# EAGLE design Omnia_MainBoard (EAGLE 9.7.0)
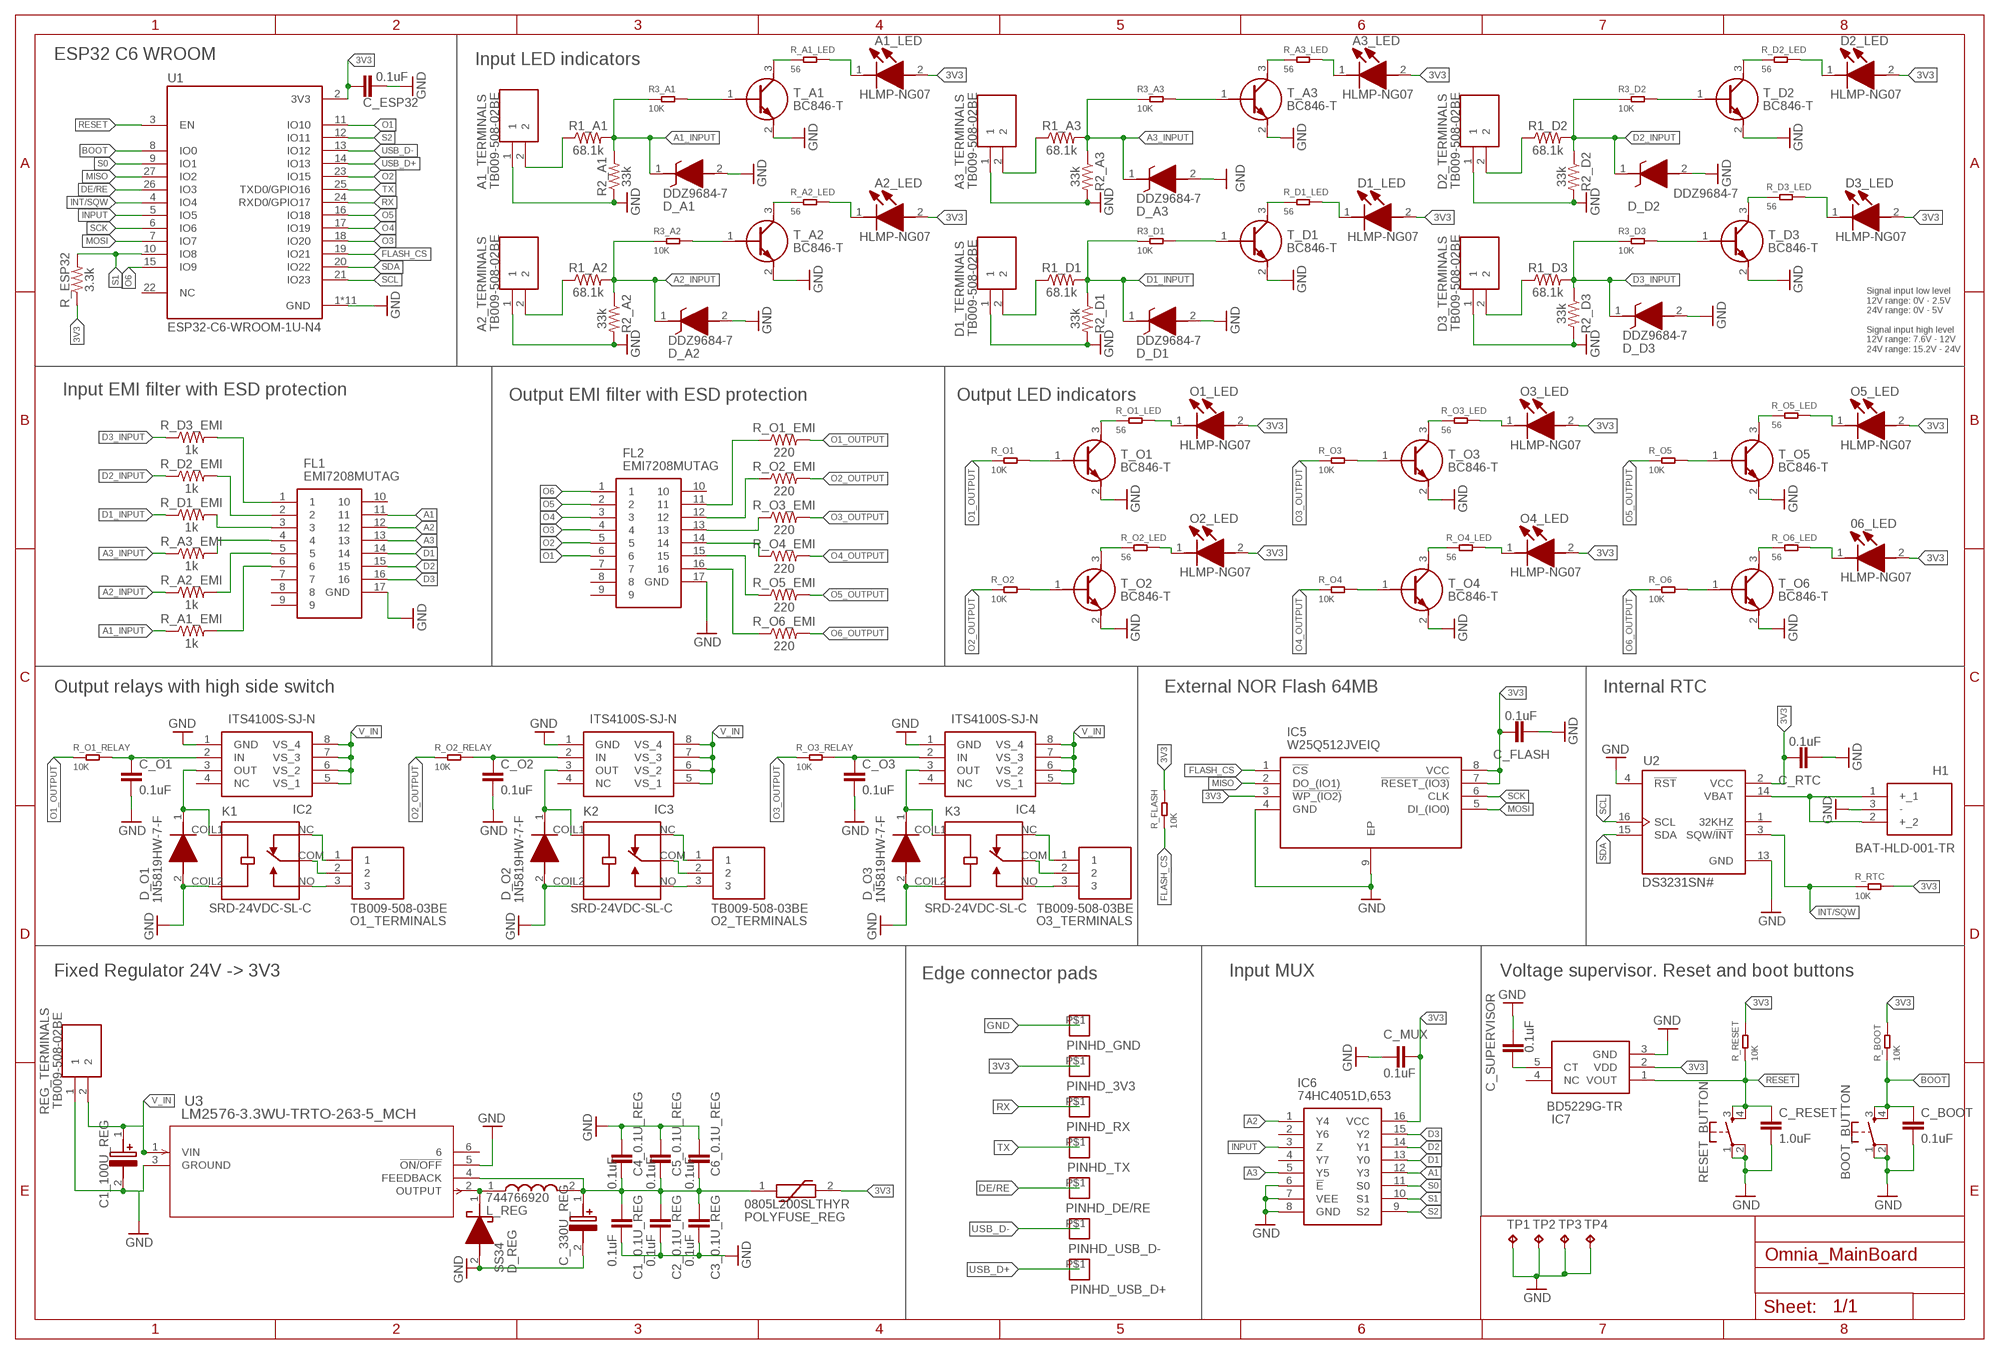
[diagram p0: schematic, sheet 1]

## Parts
06_LED  HLMP-NG07  [HLMPNG07]
A1_LED  HLMP-NG07  [HLMPNG07]
A1_TERMINALS  TB009-508-02BE  [CUI_TB009-508-02BE]
A2_LED  HLMP-NG07  [HLMPNG07]
A2_TERMINALS  TB009-508-02BE  [CUI_TB009-508-02BE]
A3_LED  HLMP-NG07  [HLMPNG07]
A3_TERMINALS  TB009-508-02BE  [CUI_TB009-508-02BE]
BOOT_BUTTON  BUTTON  SPARKFUN-SWITCHES_MOMENTARY-SWITCH-SPST-2-SMD-4.6X2.8MM  [SPARKFUN-SWITCHES_TACTILE_SWITCH_SMD_4.6X2.8MM]
C1_0.1U_REG  0.1uF  0.1UF-0402-16V-10%  [0402]
C1_100U_REG  865060653010  [CAPAE830X1050N]
C2_0.1U_REG  0.1uF  0.1UF-0402-16V-10%  [0402]
C3_0.1U_REG  0.1uF  0.1UF-0402-16V-10%  [0402]
C4_0.1U_REG  0.1uF  0.1UF-0402-16V-10%  [0402]
C5_0.1U_REG  0.1uF  0.1UF-0402-16V-10%  [0402]
C6_0.1U_REG  0.1uF  0.1UF-0402-16V-10%  [0402]
C_330U_REG  865230657014  [CAPAE1030X1080N]
C_BOOT  0.1uF  0.1UF-0402-16V-10%  [0402]
C_ESP32  0.1uF  0.1UF-0402-16V-10%  [0402]
C_FLASH  0.1uF  0.1UF-0402-16V-10%  [0402]
C_MUX  0.1uF  0.1UF-0402-16V-10%  [0402]
C_O1  0.1uF  0.1UF-0402-16V-10%  [0402]
C_O2  0.1uF  0.1UF-0402-16V-10%  [0402]
C_O3  0.1uF  0.1UF-0402-16V-10%  [0402]
C_RESET  1.0uF  1.0UF-0603-16V-10%  [0603]
C_RTC  0.1uF  0.1UF-0402-16V-10%  [0402]
C_SUPERVISOR  0.1uF  0.1UF-0402-16V-10%  [0402]
D1_LED  HLMP-NG07  [HLMPNG07]
D1_TERMINALS  TB009-508-02BE  [CUI_TB009-508-02BE]
D2_LED  HLMP-NG07  [HLMPNG07]
D2_TERMINALS  TB009-508-02BE  [CUI_TB009-508-02BE]
D3_LED  HLMP-NG07  [HLMPNG07]
D3_TERMINALS  TB009-508-02BE  [CUI_TB009-508-02BE]
D_A1  DDZ9684-7  [SOD3716X145N]
D_A2  DDZ9684-7  [SOD3716X145N]
D_A3  DDZ9684-7  [SOD3716X145N]
D_D1  DDZ9684-7  [SOD3716X145N]
D_D2  DDZ9684-7  [SOD3716X145N]
D_D3  DDZ9684-7  [SOD3716X145N]
D_O1  1N5819HW-7-F  [SOD3716X145N]
D_O2  1N5819HW-7-F  [SOD3716X145N]
D_O3  1N5819HW-7-F  [SOD3716X145N]
D_REG  SS34  [DIOM7959X262N]
FL1  EMI7208MUTAG  [EMI7208MUTAG]
FL2  EMI7208MUTAG  [EMI7208MUTAG]
H1  BAT-HLD-001-TR  [BATHLD001TR]
IC2  ITS4100S-SJ-N  [SOIC127P600X175-8N]
IC3  ITS4100S-SJ-N  [SOIC127P600X175-8N]
IC4  ITS4100S-SJ-N  [SOIC127P600X175-8N]
IC5  W25Q512JVEIQ  [SON127P800X600X80-9N]
IC6  74HC4051D,653  [74HC4051D653]
IC7  BD5229G-TR  [SOT95P280X125-5N]
K1  SRD-24VDC-SL-C  [RELAY_SRD-24VDC-SL-C]
K2  SRD-24VDC-SL-C  [RELAY_SRD-24VDC-SL-C]
K3  SRD-24VDC-SL-C  [RELAY_SRD-24VDC-SL-C]
L_REG  744766920  [INDM4532X340N]
O1_LED  HLMP-NG07  [HLMPNG07]
O1_TERMINALS  TB009-508-03BE  [CUI_TB009-508-03BE]
O2_LED  HLMP-NG07  [HLMPNG07]
O2_TERMINALS  TB009-508-03BE  [CUI_TB009-508-03BE]
O3_LED  HLMP-NG07  [HLMPNG07]
O3_TERMINALS  TB009-508-03BE  [CUI_TB009-508-03BE]
O4_LED  HLMP-NG07  [HLMPNG07]
O5_LED  HLMP-NG07  [HLMPNG07]
PINHD_3V3  CUTOUT3  [CUTOUT2]
PINHD_DE/RE  CUTOUT3  [CUTOUT2]
PINHD_GND  CUTOUT3  [CUTOUT2]
PINHD_RX  CUTOUT3  [CUTOUT2]
PINHD_TX  CUTOUT3  [CUTOUT2]
PINHD_USB_D+  CUTOUT3  [CUTOUT2]
PINHD_USB_D-  CUTOUT3  [CUTOUT2]
POLYFUSE_REG  0805L200SLTHYR  [0805L075SLYR]
R1_A1  68.1k  68.1KOHM-0603-1/10W-1%  [0603]
R1_A2  68.1k  68.1KOHM-0603-1/10W-1%  [0603]
R1_A3  68.1k  68.1KOHM-0603-1/10W-1%  [0603]
R1_D1  68.1k  68.1KOHM-0603-1/10W-1%  [0603]
R1_D2  68.1k  68.1KOHM-0603-1/10W-1%  [0603]
R1_D3  68.1k  68.1KOHM-0603-1/10W-1%  [0603]
R2_A1  33k  33KOHM-0402T-1/16W-1%  [0402-TIGHT]
R2_A2  33k  33KOHM-0402T-1/16W-1%  [0402-TIGHT]
R2_A3  33k  33KOHM-0402T-1/16W-1%  [0402-TIGHT]
R2_D1  33k  33KOHM-0402T-1/16W-1%  [0402-TIGHT]
R2_D2  33k  33KOHM-0402T-1/16W-1%  [0402-TIGHT]
R2_D3  33k  33KOHM-0402T-1/16W-1%  [0402-TIGHT]
R3_A1  10K  SMD-RES-10K-1%-1/10W(0603)  [R0603]
R3_A2  10K  SMD-RES-10K-1%-1/10W(0603)  [R0603]
R3_A3  10K  SMD-RES-10K-1%-1/10W(0603)  [R0603]
R3_D1  10K  SMD-RES-10K-1%-1/10W(0603)  [R0603]
R3_D2  10K  SMD-RES-10K-1%-1/10W(0603)  [R0603]
R3_D3  10K  SMD-RES-10K-1%-1/10W(0603)  [R0603]
R_A1_EMI  1k  1KOHM-0402T-1/16W-1%  [0402-TIGHT]
R_A1_LED  56  SMD-RES-56R-1%-1/10W(0603)  [R0603]
R_A2_EMI  1k  1KOHM-0402T-1/16W-1%  [0402-TIGHT]
R_A2_LED  56  SMD-RES-56R-1%-1/10W(0603)  [R0603]
R_A3_EMI  1k  1KOHM-0402T-1/16W-1%  [0402-TIGHT]
R_A3_LED  56  SMD-RES-56R-1%-1/10W(0603)  [R0603]
R_BOOT  10K  SMD-RES-10K-1%-1/10W(0603)  [R0603]
R_D1_EMI  1k  1KOHM-0402T-1/16W-1%  [0402-TIGHT]
R_D1_LED  56  SMD-RES-56R-1%-1/10W(0603)  [R0603]
R_D2_EMI  1k  1KOHM-0402T-1/16W-1%  [0402-TIGHT]
R_D2_LED  56  SMD-RES-56R-1%-1/10W(0603)  [R0603]
R_D3_EMI  1k  1KOHM-0402T-1/16W-1%  [0402-TIGHT]
R_D3_LED  56  SMD-RES-56R-1%-1/10W(0603)  [R0603]
R_ESP32  3.3k  3.3KOHM-0603-1/10W-1%  [0603]
R_FLASH  10K  SMD-RES-10K-1%-1/10W(0603)  [R0603]
R_O1  10K  SMD-RES-10K-1%-1/10W(0603)  [R0603]
R_O1_EMI  220  220OHM-0603-1/10W-1%  [0603]
R_O1_LED  56  SMD-RES-56R-1%-1/10W(0603)  [R0603]
R_O1_RELAY  10K  SMD-RES-10K-1%-1/10W(0603)  [R0603]
R_O2  10K  SMD-RES-10K-1%-1/10W(0603)  [R0603]
R_O2_EMI  220  220OHM-0603-1/10W-1%  [0603]
R_O2_LED  56  SMD-RES-56R-1%-1/10W(0603)  [R0603]
R_O2_RELAY  10K  SMD-RES-10K-1%-1/10W(0603)  [R0603]
R_O3  10K  SMD-RES-10K-1%-1/10W(0603)  [R0603]
R_O3_EMI  220  220OHM-0603-1/10W-1%  [0603]
R_O3_LED  56  SMD-RES-56R-1%-1/10W(0603)  [R0603]
R_O3_RELAY  10K  SMD-RES-10K-1%-1/10W(0603)  [R0603]
R_O4  10K  SMD-RES-10K-1%-1/10W(0603)  [R0603]
R_O4_EMI  220  220OHM-0603-1/10W-1%  [0603]
R_O4_LED  56  SMD-RES-56R-1%-1/10W(0603)  [R0603]
R_O5  10K  SMD-RES-10K-1%-1/10W(0603)  [R0603]
R_O5_EMI  220  220OHM-0603-1/10W-1%  [0603]
R_O5_LED  56  SMD-RES-56R-1%-1/10W(0603)  [R0603]
R_O6  10K  SMD-RES-10K-1%-1/10W(0603)  [R0603]
R_O6_EMI  220  220OHM-0603-1/10W-1%  [0603]
R_O6_LED  56  SMD-RES-56R-1%-1/10W(0603)  [R0603]
R_RESET  10K  SMD-RES-10K-1%-1/10W(0603)  [R0603]
R_RTC  10K  SMD-RES-10K-1%-1/10W(0603)  [R0603]
REG_TERMINALS  TB009-508-02BE  [CUI_TB009-508-02BE]
RESET_BUTTON  BUTTON  SPARKFUN-SWITCHES_MOMENTARY-SWITCH-SPST-2-SMD-4.6X2.8MM  [SPARKFUN-SWITCHES_TACTILE_SWITCH_SMD_4.6X2.8MM]
T_A1  BC846-T  [SOT96P250X127-3N]
T_A2  BC846-T  [SOT96P250X127-3N]
T_A3  BC846-T  [SOT96P250X127-3N]
T_D1  BC846-T  [SOT96P250X127-3N]
T_D2  BC846-T  [SOT96P250X127-3N]
T_D3  BC846-T  [SOT96P250X127-3N]
T_O1  BC846-T  [SOT96P250X127-3N]
T_O2  BC846-T  [SOT96P250X127-3N]
T_O3  BC846-T  [SOT96P250X127-3N]
T_O4  BC846-T  [SOT96P250X127-3N]
T_O5  BC846-T  [SOT96P250X127-3N]
T_O6  BC846-T  [SOT96P250X127-3N]
TP1  TPTP20SQ  [TP20SQ]
TP2  TPTP20SQ  [TP20SQ]
TP3  TPTP20SQ  [TP20SQ]
TP4  TPTP20SQ  [TP20SQ]
U1  ESP32-C6-WROOM-1U-N4  [XCVR_ESP32-C6-WROOM-1U-N4]
U2  DS3231SN#  [SOIC127P1032X265-16N]
U3  LM2576-3.3WU-TRTO-263-5_MCH  [TO-263-5_MCH]

## Nets
3V3: 06_LED.2(A) A1_LED.2(A) A2_LED.2(A) A3_LED.2(A) C1_0.1U_REG.1 C2_0.1U_REG.1 C3_0.1U_REG.1 C4_0.1U_REG.2 C5_0.1U_REG.2 C6_0.1U_REG.2 C_330U_REG.1(+) C_ESP32.2 C_FLASH.1 C_MUX.1 C_RTC.1 D1_LED.2(A) D2_LED.2(A) D3_LED.2(A) IC5.3(!WP_(IO2)) IC5.7(!RESET_(IO3)) IC5.8(VCC) IC6.16(VCC) IC7.2(VDD) L_REG.2 O1_LED.2(A) O2_LED.2(A) O3_LED.2(A) O4_LED.2(A) O5_LED.2(A) PINHD_3V3.P$1(PINHD) POLYFUSE_REG.1 POLYFUSE_REG.2 R_BOOT.2 R_ESP32.1 R_FLASH.2 R_RESET.2 R_RTC.2 U1.2(3V3) U2.2(VCC) U3.4(FEEDBACK)
A1: FL1.11 IC6.12(Y3)
A1_INPUT: D_A1.1(K) R1_A1.2 R2_A1.2 R3_A1.1 R_A1_EMI.1
A2: FL1.12 IC6.1(Y4)
A2_INPUT: D_A2.1(K) R1_A2.2 R2_A2.1 R3_A2.1 R_A2_EMI.1
A3: FL1.13 IC6.5(Y5)
A3_INPUT: D_A3.1(K) R1_A3.2 R2_A3.1 R3_A3.1 R_A3_EMI.1
BOOT: BOOT_BUTTON.3 BOOT_BUTTON.4 C_BOOT.1 R_BOOT.1 U1.8(IO0)
D1: FL1.14 IC6.13(Y0)
D1_INPUT: D_D1.1(K) R1_D1.2 R2_D1.1 R3_D1.1 R_D1_EMI.1
D2: FL1.15 IC6.14(Y1)
D2_INPUT: D_D2.1(K) R1_D2.2 R2_D2.1 R3_D2.1 R_D2_EMI.1
D3: FL1.16 IC6.15(Y2)
D3_INPUT: D_D3.1(K) R1_D3.2 R2_D3.1 R3_D3.1 R_D3_EMI.1
DE/RE: PINHD_DE/RE.P$1(PINHD) U1.26(IO3)
FLASH_CS: IC5.1(!CS) R_FLASH.1 U1.19(IO21)
GND: A1_TERMINALS.1 A2_TERMINALS.1 A3_TERMINALS.1 BOOT_BUTTON.1 BOOT_BUTTON.2 C1_0.1U_REG.2 C1_100U_REG.2(-) C2_0.1U_REG.2 C3_0.1U_REG.2 C4_0.1U_REG.1 C5_0.1U_REG.1 C6_0.1U_REG.1 C_330U_REG.2(-) C_BOOT.2 C_ESP32.1 C_FLASH.2 C_MUX.2 C_O1.2 C_O2.2 C_O3.2 C_RESET.2 C_RTC.2 C_SUPERVISOR.1 D1_TERMINALS.1 D2_TERMINALS.1 D3_TERMINALS.1 D_A1.2(A) D_A2.2(A) D_A3.2(A) D_D1.2(A) D_D2.2(A) D_D3.2(A) D_O1.2(A) D_O2.2(A) D_O3.2(A) D_REG.2(A) FL1.17(GND) FL2.17(GND) H1.3(-) IC2.1(GND) IC3.1(GND) IC4.1(GND) IC5.4(GND) IC5.9(EP) IC6.6(!E) IC6.7(VEE) IC6.8(GND) IC7.3(GND) K1.COIL2 K2.COIL2 K3.COIL2 PINHD_GND.P$1(PINHD) R2_A1.1 R2_A2.2 R2_A3.2 R2_D1.2 R2_D2.2 R2_D3.2 REG_TERMINALS.1 RESET_BUTTON.1 RESET_BUTTON.2 T_A1.2(E) T_A2.2(E) T_A3.2(E) T_D1.2(E) T_D2.2(E) T_D3.2(E) T_O1.2(E) T_O2.2(E) T_O3.2(E) T_O4.2(E) T_O5.2(E) T_O6.2(E) TP1.TP TP2.TP TP3.TP TP4.TP U1.1(GND) U1.28(GND) U1.29_1(GND) U1.29_2(GND) U1.29_3(GND) U1.29_4(GND) U1.29_5(GND) U1.29_6(GND) U1.29_7(GND) U1.29_8(GND) U1.29_9(GND) U2.4(!RST) U2.13(GND) U3.3(GROUND) U3.5(!ON/OFF)
INPUT: IC6.3(Z) U1.5(IO5)
INT/SQW: R_RTC.1 U1.4(IO4) U2.3(SQW/!INT)
MISO: IC5.2(DO_(IO1)) U1.27(IO2)
MOSI: IC5.5(DI_(IO0)) U1.7(IO7)
N$1: FL1.1 R_D3_EMI.2
N$2: FL1.2 R_D2_EMI.2
N$3: FL1.4 R_A3_EMI.2
N$4: FL1.3 R_D1_EMI.2
N$5: FL1.5 R_A2_EMI.2
N$6: FL1.6 R_A1_EMI.2
N$7: A1_TERMINALS.2 R1_A1.1
N$8: R3_A1.2 T_A1.1(B)
N$9: R_A1_LED.1 T_A1.3(C)
N$10: A2_TERMINALS.2 R1_A2.1
N$11: A1_LED.1(K) R_A1_LED.2
N$12: R3_A2.2 T_A2.1(B)
N$13: R_A2_LED.1 T_A2.3(C)
N$14: A2_LED.1(K) R_A2_LED.2
N$15: R3_A3.2 T_A3.1(B)
N$16: R_A3_LED.1 T_A3.3(C)
N$17: A3_LED.1(K) R_A3_LED.2
N$18: R3_D1.2 T_D1.1(B)
N$19: R_D1_LED.1 T_D1.3(C)
N$20: D1_LED.1(K) R_D1_LED.2
N$21: D1_TERMINALS.2 R1_D1.1
N$22: A3_TERMINALS.2 R1_A3.1
N$23: D2_TERMINALS.2 R1_D2.1
N$24: D3_TERMINALS.2 R1_D3.1
N$25: R_D2_LED.1 T_D2.3(C)
N$26: D2_LED.1(K) R_D2_LED.2
N$27: R3_D2.2 T_D2.1(B)
N$28: R_D3_LED.1 T_D3.3(C)
N$29: R3_D3.2 T_D3.1(B)
N$30: D3_LED.1(K) R_D3_LED.2
N$31: R_O1_LED.1 T_O1.3(C)
N$32: O1_LED.1(K) R_O1_LED.2
N$33: R_O2_LED.1 T_O2.3(C)
N$34: FL2.14 R_O4_EMI.1
N$35: FL2.13 R_O3_EMI.1
N$36: FL2.12 R_O2_EMI.1
N$37: FL2.11 R_O1_EMI.1
N$38: FL2.15 R_O5_EMI.1
N$39: FL2.16 R_O6_EMI.1
N$40: R_O5.2 T_O5.1(B)
N$41: R_O1.2 T_O1.1(B)
N$42: O2_LED.1(K) R_O2_LED.2
N$43: R_O3_LED.1 T_O3.3(C)
N$44: O3_LED.1(K) R_O3_LED.2
N$45: R_O2.2 T_O2.1(B)
N$46: R_O4_LED.1 T_O4.3(C)
N$47: O4_LED.1(K) R_O4_LED.2
N$48: R_O5_LED.1 T_O5.3(C)
N$49: O5_LED.1(K) R_O5_LED.2
N$50: R_O4.2 T_O4.1(B)
N$51: R_O3.2 T_O3.1(B)
N$52: R_O6_LED.1 T_O6.3(C)
N$53: 06_LED.1(K) R_O6_LED.2
N$54: K1.NO O1_TERMINALS.3
N$55: K1.COM O1_TERMINALS.2
N$56: R_O6.2 T_O6.1(B)
N$57: K1.NC O1_TERMINALS.1
N$58: C_O1.1 IC2.2(IN) R_O1_RELAY.2
N$59: D_O1.1(K) IC2.3(OUT) K1.COIL1
N$60: K2.NO O2_TERMINALS.3
N$61: K2.COM O2_TERMINALS.2
N$62: K2.NC O2_TERMINALS.1
N$63: C_O2.1 IC3.2(IN) R_O2_RELAY.2
N$64: D_O2.1(K) IC3.3(OUT) K2.COIL1
N$65: K3.NO O3_TERMINALS.3
N$66: K3.COM O3_TERMINALS.2
N$67: K3.NC O3_TERMINALS.1
N$68: C_O3.1 IC4.2(IN) R_O3_RELAY.2
N$69: D_O3.1(K) IC4.3(OUT) K3.COIL1
N$71: C_SUPERVISOR.2 IC7.5(CT)
N$76: H1.1(+_1) H1.2(+_2) U2.14(VBAT)
N$77: D_REG.1(K) L_REG.1 U3.2(OUTPUT)
O1: FL2.6 U1.11(IO10)
O1_OUTPUT: R_O1.1 R_O1_EMI.2 R_O1_RELAY.1
O2: FL2.5 U1.23(IO15)
O2_OUTPUT: R_O2.1 R_O2_EMI.2 R_O2_RELAY.1
O3: FL2.4 U1.18(IO20)
O3_OUTPUT: R_O3.1 R_O3_EMI.2 R_O3_RELAY.1
O4: FL2.3 U1.17(IO19)
O4_OUTPUT: R_O4.1 R_O4_EMI.2
O5: FL2.2 U1.16(IO18)
O5_OUTPUT: R_O5.1 R_O5_EMI.2
O6: FL2.1 U1.15(IO9)
O6_OUTPUT: R_O6.1 R_O6_EMI.2
RESET: C_RESET.1 IC7.1(VOUT) R_RESET.1 RESET_BUTTON.3 RESET_BUTTON.4 U1.3(EN)
RX: PINHD_RX.P$1(PINHD) U1.24(RXD0/GPIO17)
S0: IC6.11(S0) U1.9(IO1)
S1: IC6.10(S1) R_ESP32.2 U1.10(IO8)
S2: IC6.9(S2) U1.12(IO11)
SCK: IC5.6(CLK) U1.6(IO6)
SCL: U1.21(IO23) U2.16(SCL)
SDA: U1.20(IO22) U2.15(SDA)
TX: PINHD_TX.P$1(PINHD) U1.25(TXD0/GPIO16)
USB_D+: PINHD_USB_D+.P$1(PINHD) U1.14(IO13)
USB_D-: PINHD_USB_D-.P$1(PINHD) U1.13(IO12)
V_IN: C1_100U_REG.1(+) IC2.5(VS_1) IC2.6(VS_2) IC2.7(VS_3) IC2.8(VS_4) IC3.5(VS_1) IC3.6(VS_2) IC3.7(VS_3) IC3.8(VS_4) IC4.5(VS_1) IC4.6(VS_2) IC4.7(VS_3) IC4.8(VS_4) REG_TERMINALS.2 U3.1(VIN)
Unconnected: FL1.7 FL1.8 FL1.9 FL1.10 FL2.7 FL2.8 FL2.9 FL2.10 IC2.4(NC) IC3.4(NC) IC4.4(NC) IC6.2(Y6) IC6.4(Y7) IC7.4(NC) U1.22(NC) U2.1(32KHZ) U3.6

## Notes on the sheet
- ESP32 C6 WROOM | Input LED indicators
- Signal input low level
  12V range: 0V - 2.5V
  24V range: 0V - 5V
  
  Signal input high level
  12V range: 7.6V - 12V
  24V range: 15.2V - 24V
- Input EMI filter with ESD protection
- Output EMI filter with ESD protection | Output LED indicators
- Output relays with high side switch | External NOR Flash 64MB | Internal RTC
- Fixed Regulator 24V -> 3V3 | Edge connector pads | Input MUX | Voltage supervisor. Reset and boot buttons

## Library data of the parts
06_LED A1_LED A2_LED A3_LED D1_LED D2_LED D3_LED O1_LED O2_LED O3_LED O4_LED O5_LED = HLMP-NG07:HLMP-NG07: T-1 (3 mm) Auto Insertable LED Lamp Source: Datasheet <https://www.broadcom.com/products/leds-and-displays/standard-brightness/3mm-t1/hlmp-ng07>; DESCRIPTION: T-1 (3 mm) Auto Insertable LED Lamp; HEIGHT: 6.2mm; MANUFACTURER_NAME: Avago Technologies; MANUFACTURER_PART_NUMBER: HLMP-NG07; MOUSER_PART_NUMBER: 630-HLMP-NG07; MOUSER_PRICE-STOCK: https://www.mouser.co.uk/ProductDetail/Broadcom-Avago/HLMP-NG07?qs=YDL0qNrpDT4I2OHCH4sdbA%3D%3D
A1_TERMINALS A2_TERMINALS A3_TERMINALS D1_TERMINALS D2_TERMINALS D3_TERMINALS REG_TERMINALS = TB009-508-02BE:TB009-508-02BE: Check availability <https://pricing.snapeda.com/parts/TB009-508-02BE/Same%20Sky/view-part?ref=eda>; AVAILABILITY: In Stock; CHECK_PRICES: https://www.snapeda.com/parts/TB009-508-02BE/Same+Sky/view-part/?ref=eda; DESCRIPTION: 2~24 Poles, Screw Type, Horizontal, 5.08 Pitch, 26~12 (AWG), Terminal Block Connector; MF: Same Sky; MP: TB009-508-02BE; PACKAGE: None; PRICE: None; SNAPEDA_LINK: https://www.snapeda.com/parts/TB009-508-02BE/Same+Sky/view-part/?ref=snap
BOOT_BUTTON RESET_BUTTON = Hector_Watch:SPARKFUN-SWITCHES_MOMENTARY-SWITCH-SPST-2: Momentary Switch (Pushbutton) - SPST - Two Circuits Normally-open (NO) SPST momentary switches (buttons, pushbuttons). Schematic symbol includes two switch circuits. Variants SMD-4.6MMX2.8MM - 4.60mm x 2.80mm Tactile Momentary Button Switch - Used on SparkFun SAMD21 Mini Breakout <https://www.sparkfun.com/products/13664> SMD-5.2MM - Mini Pushbutton Switch - SMD <https://www.sparkfun.com/products/8720> - Used on Arduino Pro Mini <https://www.sparkfun.com/products/11114>; PROD_ID: SWCH-14139; SF_SKU: COM-08720
C1_0.1U_REG C2_0.1U_REG C3_0.1U_REG C4_0.1U_REG C5_0.1U_REG C6_0.1U_REG C_BOOT C_ESP32 C_FLASH C_MUX C_O1-C_O3 C_RTC C_SUPERVISOR = SparkFun-Capacitors:0.1UF: 0.1µF ceramic capacitors A capacitor is a passive two-terminal electrical component used to store electrical energy temporarily in an electric field.; PROD_ID: CAP-12416
C1_100U_REG = 865060653010:865060653010: Wurth Elektronik 100uF Electrolytic Capacitor 50V dc, Surface Mount - 865060653010 Source: Datasheet <https://componentsearchengine.com/Datasheets/2/865060653010.pdf>; DESCRIPTION: Wurth Elektronik 100uF Electrolytic Capacitor 50V dc, Surface Mount - 865060653010; HEIGHT: 10.5mm; MANUFACTURER_NAME: Wurth Elektronik; MANUFACTURER_PART_NUMBER: 865060653010; MOUSER_PART_NUMBER: 710-865060653010; MOUSER_PRICE-STOCK: https://www.mouser.co.uk/ProductDetail/Wurth-Elektronik/865060653010?qs=0KOYDY2FL2%252BoVBl9%252BvxW%2Fg%3D%3D
C_330U_REG = 865230657014:865230657014: Aluminium Electrolytic Capacitors - SMD WCAP-AS5H 330uF 50V 20% Source: Datasheet <https://www.we-online.com/components/products/datasheet/865230657014.pdf>; DESCRIPTION: Aluminium Electrolytic Capacitors - SMD WCAP-AS5H 330uF 50V 20%; HEIGHT: 10.8mm; MANUFACTURER_NAME: Wurth Elektronik; MANUFACTURER_PART_NUMBER: 865230657014; MOUSER_PART_NUMBER: 710-865230657014; MOUSER_PRICE-STOCK: https://www.mouser.co.uk/ProductDetail/Wurth-Elektronik/865230657014?qs=amGC7iS6iy8zviggKveCLg%3D%3D
C_RESET = SparkFun-Capacitors:1.0UF: 1µF ceramic capacitors A capacitor is a passive two-terminal electrical component used to store electrical energy temporarily in an electric field.; PROD_ID: CAP-00868
D_A1-D_A3 D_D1-D_D3 = DDZ9684-7:DDZ9684-7: Zener Diodes 500MW 3.3V Source: Datasheet <https://www.diodes.com//assets/Datasheets/ds30410.pdf>; DESCRIPTION: Zener Diodes 500MW 3.3V; HEIGHT: 1.45mm; MANUFACTURER_NAME: Diodes Incorporated; MANUFACTURER_PART_NUMBER: DDZ9684-7; MOUSER_PART_NUMBER: 621-DDZ9684-7; MOUSER_PRICE-STOCK: https://www.mouser.co.uk/ProductDetail/Diodes-Incorporated/DDZ9684-7?qs=mQbszxtPdlN5OVpmKRGZYw%3D%3D
D_O1-D_O3 = 1N5819HW-7-F:1N5819HW-7-F: Diode Schottky 1A 40V SOD123 Diodes Inc 1N5819HW-7-F, SMT Schottky Diode, 40V 1A, 2-Pin SOD-123 Source: Datasheet <https://www.diodes.com//assets/Datasheets/1N5819HW.pdf>; DESCRIPTION: Diode Schottky 1A 40V SOD123 Diodes Inc 1N5819HW-7-F, SMT Schottky Diode, 40V 1A, 2-Pin SOD-123; HEIGHT: 1.45mm; MANUFACTURER_NAME: Diodes Incorporated; MANUFACTURER_PART_NUMBER: 1N5819HW-7-F; MOUSER_PART_NUMBER: 621-1N5819HW-F; MOUSER_PRICE-STOCK: https://www.mouser.co.uk/ProductDetail/Diodes-Incorporated/1N5819HW-7-F?qs=NQ47qNm99eDyWTEd07miYA%3D%3D
D_REG = SS34:SS34: TAIWAN SEMICONDUCTOR - SS34 - DIODE, SCHOTTKY, 3A, 40V Source: Datasheet <https://componentsearchengine.com/Datasheets/1/SS34.pdf>; DESCRIPTION: TAIWAN SEMICONDUCTOR - SS34 - DIODE, SCHOTTKY, 3A, 40V; HEIGHT: 2.62mm; MANUFACTURER_NAME: Taiwan Semiconductor; MANUFACTURER_PART_NUMBER: SS34; MOUSER_PART_NUMBER: 821-SS34; MOUSER_PRICE-STOCK: https://www.mouser.co.uk/ProductDetail/Taiwan-Semiconductor/SS34?qs=JV7lzlMm3yIimVqgKV%2F1SA%3D%3D
FL1 FL2 = EMI7208MUTAG:EMI7208MUTAG: ESD Suppressors / TVS Diodes 8 CH EMI FILTER W/ESD Source: Datasheet <https://componentsearchengine.com/Datasheets/1/EMI7208MUTAG.pdf>; DESCRIPTION: ESD Suppressors / TVS Diodes 8 CH EMI FILTER W/ESD; HEIGHT: 0.55mm; MANUFACTURER_NAME: onsemi; MANUFACTURER_PART_NUMBER: EMI7208MUTAG
H1 = BAT-HLD-001-TR:BAT-HLD-001-TR: Battery Holders, CR2032, 1 Position, Horizontal, Nickel, PCB Mount Alignment, Power, -40 257 F [-40 125 C] Source: Datasheet <https://www.te.com/commerce/DocumentDelivery/DDEController?Action=showdoc&DocId=Customer DrawingC-BAT-HLD-001-xxE1pdfEnglishENG_CD_C-BAT-HLD-001-xx_E1.pdfBAT-HLD-001-TR>; DESCRIPTION: Battery Holders, CR2032, 1 Position, Horizontal, Nickel, PCB Mount Alignment, Power, -40 257 F [-40 125 C]; HEIGHT: 4.4mm; MANUFACTURER_NAME: TE Connectivity; MANUFACTURER_PART_NUMBER: BAT-HLD-001-TR; MOUSER_PART_NUMBER: 712-BAT-HLD-001-TR; MOUSER_PRICE-STOCK: https://www.mouser.co.uk/ProductDetail/TE-Connectivity-Linx-Technologies/BAT-HLD-001-TR?qs=K5ta8V%252BWhtZh3MyWmkkmjQ%3D%3D
IC2-IC4 = ITS4100S-SJ-N:ITS4100S-SJ-N: Power Switch ICs - Power Distribution MINI-PROFET Source: Datasheet <https://www.infineon.com/dgdl/Infineon-ITS4100S-SJ-N-DataSheet-v01_10-EN.pdf?fileId=5546d4626c1f3dc3016c9049397e2318>; DESCRIPTION: Power Switch ICs - Power Distribution MINI-PROFET; HEIGHT: 1.75mm; MANUFACTURER_NAME: Infineon; MANUFACTURER_PART_NUMBER: ITS4100S-SJ-N; MOUSER_PART_NUMBER: 726-ITS4100S-SJ-N; MOUSER_PRICE-STOCK: https://www.mouser.co.uk/ProductDetail/Infineon-Technologies/ITS4100S-SJ-N?qs=XxWtqqdu%2F9HIEwZgkNvkfA%3D%3D
IC5 = W25Q512JVEIQ:W25Q512JVEIQ: 512Mb Serial NOR Flash 133MHz SON8 Source: Datasheet <https://www.winbond.com/hq/search-resource-file.jsp?partNo=W25Q512JVEIQ&type=datasheet>; DESCRIPTION: 512Mb Serial NOR Flash 133MHz SON8; HEIGHT: 0.8mm; MANUFACTURER_NAME: Winbond; MANUFACTURER_PART_NUMBER: W25Q512JVEIQ; MOUSER_PART_NUMBER: 454-W25Q512JVEIQ; MOUSER_PRICE-STOCK: https://www.mouser.co.uk/ProductDetail/Winbond/W25Q512JVEIQ?qs=l7cgNqFNU1jw6svr3at6tA%3D%3D
IC6 = 74HC4051D_653:74HC4051D,653: 74HC4051; 74HCT4051 - 8-channel analog multiplexer/demultiplexer@en-us Source: Datasheet <https://assets.nexperia.com/documents/data-sheet/74HC_HCT4051.pdf>; DESCRIPTION: 74HC4051; 74HCT4051 - 8-channel analog multiplexer/demultiplexer@en-us; HEIGHT: 1.75mm; MANUFACTURER_NAME: Nexperia; MANUFACTURER_PART_NUMBER: 74HC4051D,653; MOUSER_PART_NUMBER: 771-74HC4051D-T; MOUSER_PRICE-STOCK: https://www.mouser.co.uk/ProductDetail/Nexperia/74HC4051D653?qs=P62ublwmbi%2FWMqN3hyrSvQ%3D%3D
IC7 = BD5229G-TR:BD5229G-TR: Voltage Detector with Adjustable Delay Time: CMOS processes are utilized to develop high precision, low current consumption CMOS reset ICs that allow arbitrary setting of the delay time. The extensive lineup includes both Nch Open Drain and CMOS output types in a wide range of detection voltages (from 2.3V to 6.0V, in 0.1V steps), enabling selection of the ideal solution based on customer requirements. In addition, the entire series is of course both lead-free and RoHS-compliant. Source: Datasheet <https://datasheet.datasheetarchive.com/originals/distributors/Datasheets_SAMA/f2b9741ef86007909f138d561a359946.pdf>; DESCRIPTION: Voltage Detector with Adjustable Delay Time: CMOS processes are utilized to develop high precision, low current consumption CMOS reset ICs that allow arbitrary setting of the delay time. The extensive lineup includes both Nch Open Drain and CMOS output types in a wide range of detection voltages (from 2.3V to 6.0V, in 0.1V steps), enabling selection of the ideal solution based on customer requirements. In addition, the entire series is of course both lead-free and RoHS-compliant.; HEIGHT: 1.25mm; MANUFACTURER_NAME: ROHM Semiconductor; MANUFACTURER_PART_NUMBER: BD5229G-TR; MOUSER_PART_NUMBER: 755-BD5229G-TR; MOUSER_PRICE-STOCK: https://www.mouser.co.uk/ProductDetail/ROHM-Semiconductor/BD5229G-TR?qs=4kLU8WoGk0vvnhrrYwdszw%3D%3D
K1-K3 = SRD-24VDC-SL-C:SRD-24VDC-SL-C: Check availability <https://pricing.snapeda.com/parts/SRD-24VDC-SL-C/Songle%20Relay/view-part?ref=eda>; AVAILABILITY: Not in stock; CHECK_PRICES: https://www.snapeda.com/parts/SRD-24VDC-SL-C/Songle+Relay/view-part/?ref=eda; MF: Songle Relay; MP: SRD-24VDC-SL-C; PACKAGE: NON STANDARD-5 Songle Relay; PRICE: None; SNAPEDA_LINK: https://www.snapeda.com/parts/SRD-24VDC-SL-C/Songle+Relay/view-part/?ref=snap
L_REG = 744766920:744766920: Wurth WE-GFH Series Wire-wound SMD Inductor with a Iron Core, 100 uH Moulded 275mA Idc Q:40 Source: Datasheet <https://componentsearchengine.com/Datasheets/2/744766920.pdf>; DESCRIPTION: Wurth WE-GFH Series Wire-wound SMD Inductor with a Iron Core, 100 uH Moulded 275mA Idc Q:40; HEIGHT: 3.4mm; MANUFACTURER_NAME: Wurth Elektronik; MANUFACTURER_PART_NUMBER: 744766920; MOUSER_PART_NUMBER: 710-744766920; MOUSER_PRICE-STOCK: https://www.mouser.co.uk/ProductDetail/Wurth-Elektronik/744766920?qs=HXx4m3XcTe2Xvw4swesQ4A%3D%3D
O1_TERMINALS O2_TERMINALS O3_TERMINALS = TB009-508-03BE:TB009-508-03BE: Check availability <https://pricing.snapeda.com/parts/TB009-508-03BE/Same%20Sky/view-part?ref=eda>; AVAILABILITY: In Stock; CHECK_PRICES: https://www.snapeda.com/parts/TB009-508-03BE/Same+Sky/view-part/?ref=eda; DESCRIPTION: 2~24 Poles, Screw Type, Horizontal, 5.08 Pitch, 26~12 (AWG), Terminal Block Connector; MF: Same Sky; MP: TB009-508-03BE; PACKAGE: None; PRICE: None; SNAPEDA_LINK: https://www.snapeda.com/parts/TB009-508-03BE/Same+Sky/view-part/?ref=snap
PINHD_3V3 PINHD_DE/RE PINHD_GND PINHD_RX PINHD_TX PINHD_USB_D+ PINHD_USB_D- = Library_cutout:CUTOUT3
POLYFUSE_REG = 0805L200SLTHYR:0805L200SLTHYR: Low Rho Surface Mount Resettable PTC Fuse Source: Datasheet <https://m.littelfuse.com/~/media/electronics/datasheets/resettable_ptcs/littelfuse_ptc_lorho_datasheet.pdf.pdf>; DESCRIPTION: Low Rho Surface Mount Resettable PTC Fuse; HEIGHT: 0.75mm; MANUFACTURER_NAME: LITTELFUSE; MANUFACTURER_PART_NUMBER: 0805L200SLTHYR; MOUSER_PART_NUMBER: 576-0805L200SLTHYR; MOUSER_PRICE-STOCK: https://www.mouser.co.uk/ProductDetail/Littelfuse/0805L200SLTHYR?qs=l%252BmC%252BYUP1cqCIkGjjBrLUw%3D%3D
R1_A1-R1_A3 R1_D1-R1_D3 = SparkFun-Resistors:68.1KOHM: 68.1kΩ resistor A resistor is a passive two-terminal electrical component that implements electrical resistance as a circuit element. Resistors act to reduce current flow, and, at the same time, act to lower voltage levels within circuits. - Wikipedia; PROD_ID: RES-09380
R2_A1-R2_A3 R2_D1-R2_D3 = SparkFun-Resistors:33KOHM: 33kΩ resistor A resistor is a passive two-terminal electrical component that implements electrical resistance as a circuit element. Resistors act to reduce current flow, and, at the same time, act to lower voltage levels within circuits. - Wikipedia; PROD_ID: RES-15128
R3_A1-R3_A3 R3_D1-R3_D3 R_BOOT R_FLASH R_O1 R_O1_RELAY R_O2 R_O2_RELAY R_O3 R_O3_RELAY R_O4-R_O6 R_RESET R_RTC = OPL_Resistor:SMD-RES-10K-1%-1/10W(0603): 301011970; MPN: RC0603FR-0710KL
R_A1_EMI R_A2_EMI R_A3_EMI R_D1_EMI R_D2_EMI R_D3_EMI = SparkFun-Resistors:1KOHM: 1kΩ resistor A resistor is a passive two-terminal electrical component that implements electrical resistance as a circuit element. Resistors act to reduce current flow, and, at the same time, act to lower voltage levels within circuits. - Wikipedia; PROD_ID: RES-14342
R_A1_LED R_A2_LED R_A3_LED R_D1_LED R_D2_LED R_D3_LED R_O1_LED R_O2_LED R_O3_LED R_O4_LED R_O5_LED R_O6_LED = OPL_Resistor:SMD-RES-56R-1%-1/10W(0603): 301012087; MPN: RC0603FR-071K5L; VALUE: 1.5K
R_ESP32 = SparkFun-Resistors:3.3KOHM: 3.3kΩ resistor A resistor is a passive two-terminal electrical component that implements electrical resistance as a circuit element. Resistors act to reduce current flow, and, at the same time, act to lower voltage levels within circuits. - Wikipedia; PROD_ID: RES-07851
R_O1_EMI R_O2_EMI R_O3_EMI R_O4_EMI R_O5_EMI R_O6_EMI = SparkFun-Resistors:220OHM: 220Ω resistor A resistor is a passive two-terminal electrical component that implements electrical resistance as a circuit element. Resistors act to reduce current flow, and, at the same time, act to lower voltage levels within circuits. - Wikipedia; PROD_ID: RES-07861
T_A1-T_A3 T_D1-T_D3 T_O1-T_O6 = BC846-T:BC846-T: Bipolar Transistors - BJT Ep Trans NPN,0.1A,65V Source: Datasheet; DESCRIPTION: Bipolar Transistors - BJT Ep Trans NPN,0.1A,65V; HEIGHT: 1.27mm; MANUFACTURER_NAME: Rectron; MANUFACTURER_PART_NUMBER: BC846-T; MOUSER_PART_NUMBER: 583-BC846; MOUSER_PRICE-STOCK: https://www.mouser.co.uk/ProductDetail/Rectron/BC846-T?qs=Pkg3F8W3dt6cUIu%2FpkDz7A%3D%3D
TP1-TP4 = testpad:TP: Test pad
U1 = ESP32-C6-WROOM-1U-N4:ESP32-C6-WROOM-1U-N4: Check availability <https://pricing.snapeda.com/parts/ESP32-C6-WROOM-1U-N4/Espressif%20Systems/view-part?ref=eda>; AVAILABILITY: In Stock; CHECK_PRICES: https://www.snapeda.com/parts/ESP32-C6-WROOM-1U-N4/Espressif+Systems/view-part/?ref=eda; DESCRIPTION: 802.15.4, Bluetooth, WiFi 802.11ax, Bluetooth v5.3, Zigbee® Transceiver Module 2.4GHz Antenna Not Included, U.FL Surface Mount; MF: Espressif Systems; MP: ESP32-C6-WROOM-1U-N4; PACKAGE: None; PRICE: None; PURCHASE-URL: https://www.snapeda.com/api/url_track_click_mouser/?unipart_id=13943420&manufacturer=Espressif Systems&part_name=ESP32-C6-WROOM-1U-N4&search_term=None; SNAPEDA_LINK: https://www.snapeda.com/parts/ESP32-C6-WROOM-1U-N4/Espressif+Systems/view-part/?ref=snap
U2 = DS3231SN_:DS3231SN#: Check availability <https://pricing.snapeda.com/parts/DS3231SN%23/Maxim%20Integrated%20Products/view-part?ref=eda>; AVAILABILITY: Not in stock; CHECK_PRICES: https://www.snapeda.com/parts/DS3231SN%23/Maxim+Integrated/view-part/?ref=eda; DESCRIPTION: Real Time Clock (RTC) IC Clock/Calendar I2C, 2-Wire Serial 16-SOIC (0.295, 7.50mm Width); MF: Maxim Integrated Products; MP: DS3231SN#; PACKAGE: None; PRICE: None; SNAPEDA_LINK: https://www.snapeda.com/parts/DS3231SN%23/Maxim+Integrated/view-part/?ref=snap
U3 = 2025-03-02_14-36-12_Library:LM2576-3.3WU-TR; COPYRIGHT: Copyright (C) 2025 Ultra Librarian. All rights reserved.; MANUFACTURER_PART_NUMBER: LM2576-3.3WU-TR; MFR_NAME: Microchip

## Board
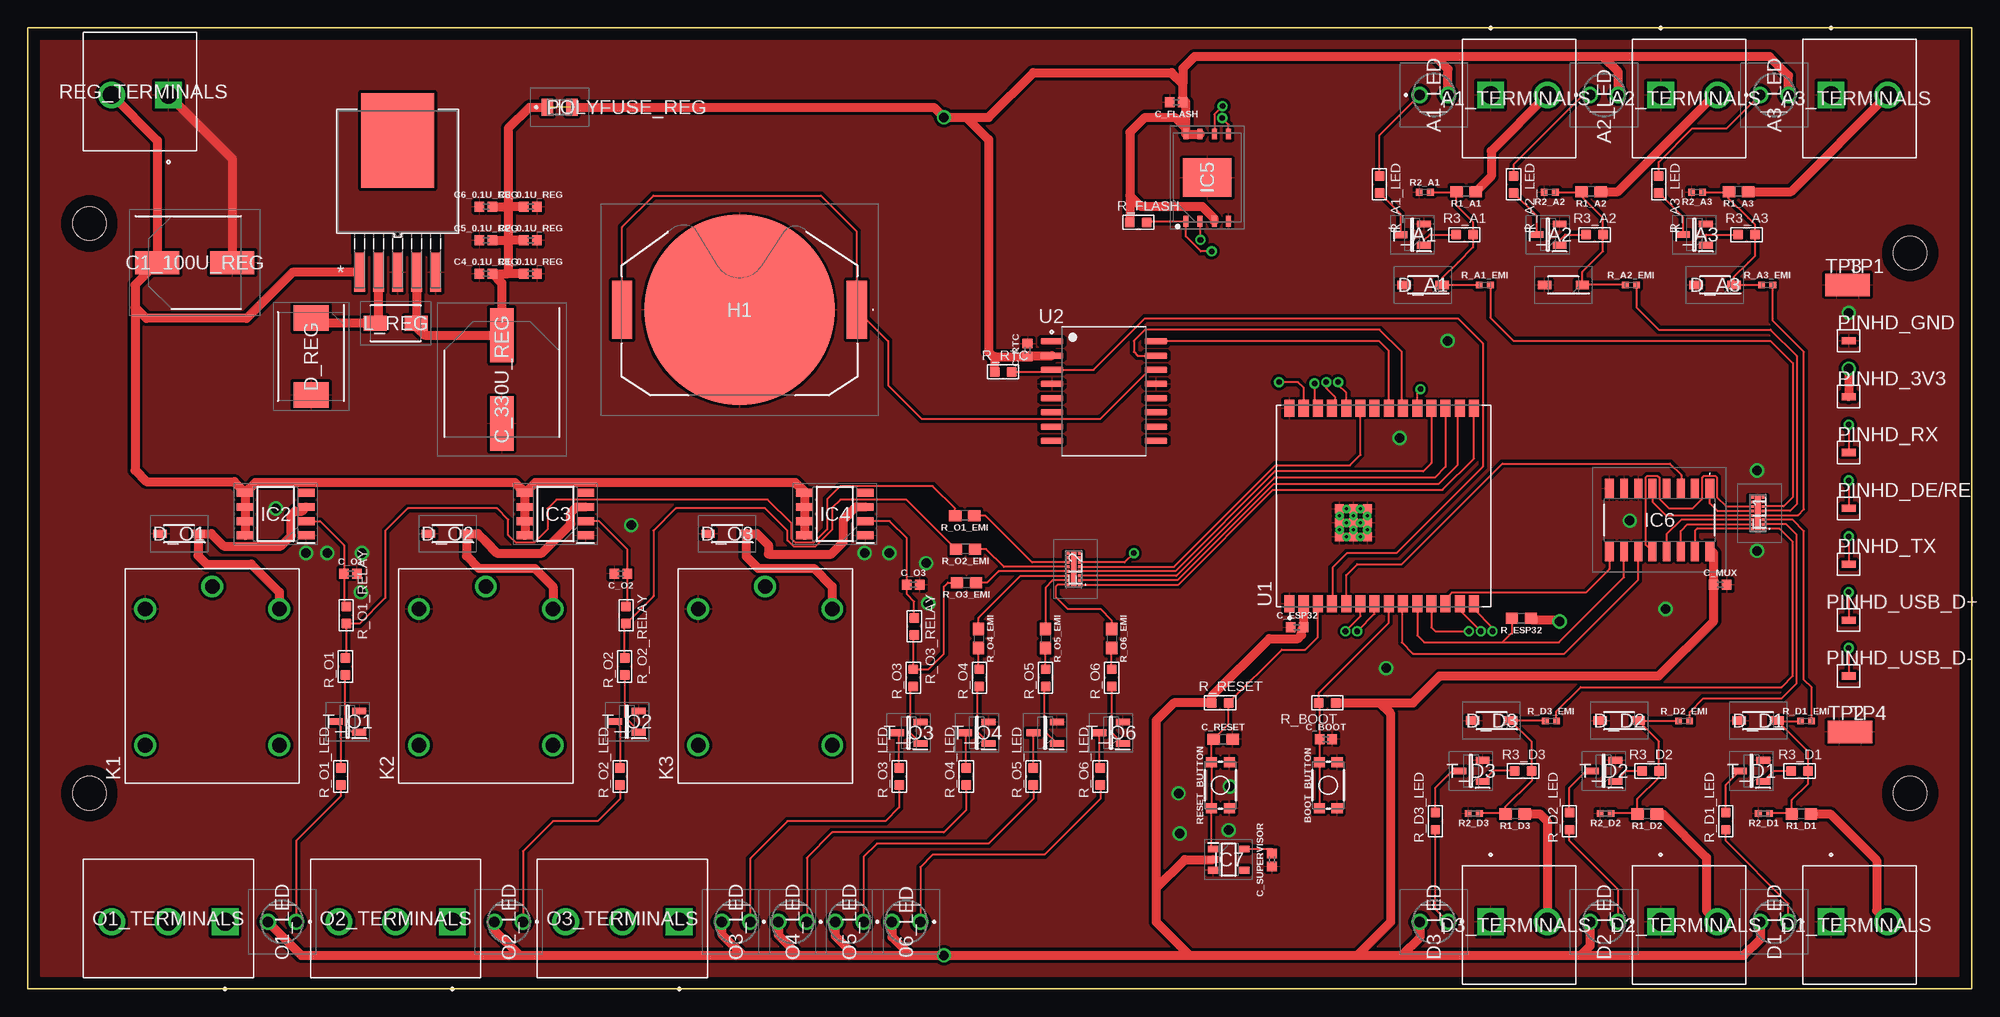
[diagram p1: board, top side]
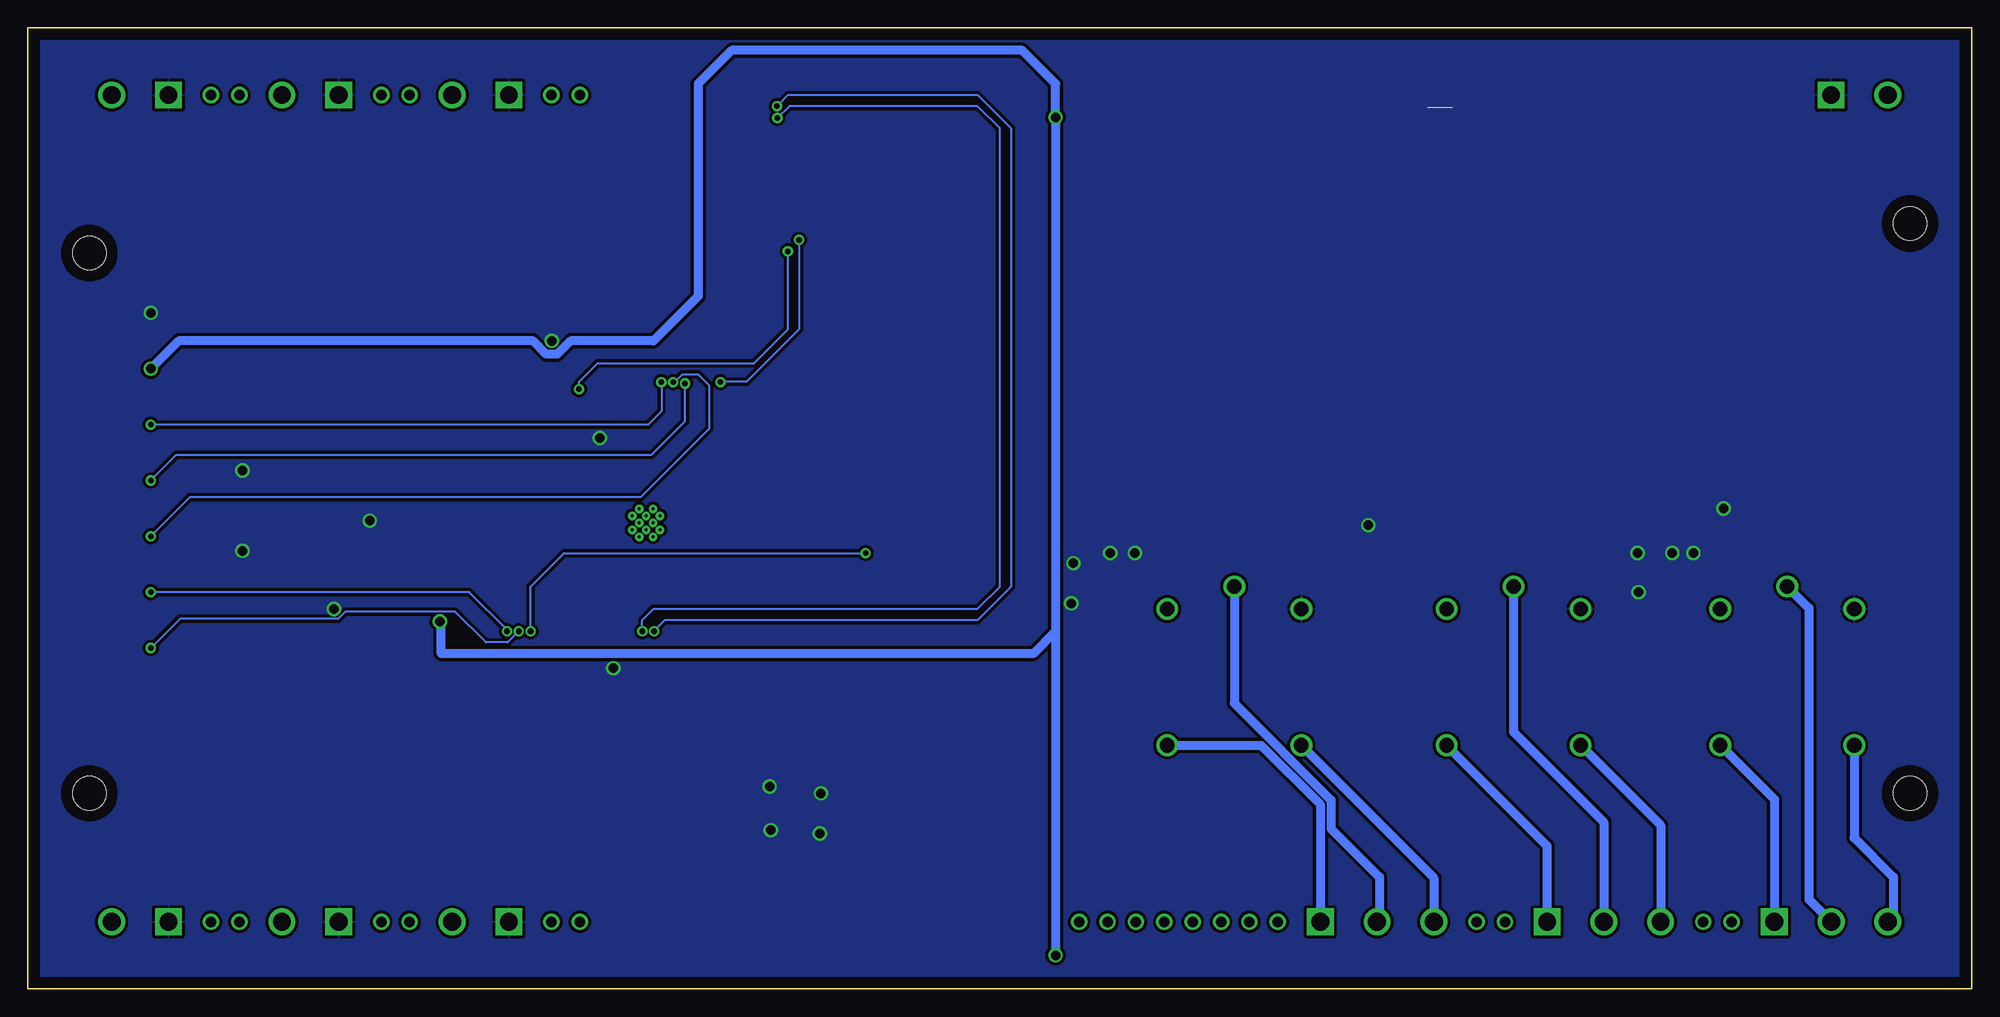
[diagram p2: board, bottom side, seen from below]

Size 174 x 86 mm. Coordinates in mm from the lower left corner, seen from the top.
Outline: 0,0 174,0 174,86 0,86 0,72 0,14 0,0
Copper layers (1*16): Top / Bottom
Stack-up Default Layer Stack: Top User Defined 0.035mm / Dielectric-1 User Defined 1.5mm / Bottom User Defined 0.035mm
Design rules: minimum drill size 0.35mm, copper clearance wire_polygon to wire_polygon 6mil, copper clearance wire_polygon to pad_smd 6mil, copper clearance wire_polygon to via 6mil, copper clearance pad_smd to pad_smd 6mil, copper clearance pad_smd to via 6mil, copper clearance via to via 6mil, copper clearance smd to pad (same net) 6mil, copper clearance smd to via (same net) 6mil, copper clearance smd to smd (same net) 6mil, dimension clearance 40mil, via restrict clearance 0mil, restrict clearance 0mil, drill distance 6mil, keepout clearance 0mil
Holes 3 mm at 168.5,65.85 168.5,17.5 5.5,68.5 5.5,17.5

### Footprints (pad centres in the part's own frame; a part is rotated, then mirrored left to right if it is on the bottom)
HLMPNG07 = drill 0.94 pad 1.462: 1 0,1.27; 2 0,-1.27
CUI_TB009-508-02BE = drill 1.6 square: 1 0,0 | drill 1.6: 2 5.08,0
SPARKFUN-SWITCHES_TACTILE_SWITCH_SMD_4.6X2.8MM = smd 0.9 x 1: 1 -2.05,-0.8; 2 2.05,-0.8; 3 2.05,0.8; 4 -2.05,0.8
0402 = smd 0.85 x 0.9: 1 -0.58,0; 2 0.58,0
CAPAE830X1050N = smd 3.95 x 2.05: 1 -3.35,0; 2 3.35,0
CAPAE1030X1080N = smd 4.85 x 2.1: 1 -3.95,0; 2 3.95,0
0603 = smd 1.1 x 1: 1 -0.85,0; 2 0.85,0
SOD3716X145N = smd 1.2 x 0.75: 1 -1.7,0; 2 1.7,0
DIOM7959X262N = smd 2.3 x 3.15: 1 -3.45,0; 2 3.45,0
EMI7208MUTAG = smd 0.25 x 0.4: 1 -1.4,-0.575; 2 -1,-0.575; 3 -0.6,-0.575; 4 -0.2,-0.575; 5 0.2,-0.575; 6 0.6,-0.575; 7 1,-0.575; 8 1.4,-0.575; 9 1.4,0.575; 10 1,0.575; 11 0.6,0.575; 12 0.2,0.575; 13 -0.2,0.575; 14 -0.6,0.575; 15 -1,0.575; 16 -1.4,0.575 | smd 3 x 0.5: 17 0,0
BATHLD001TR = smd 1.8 x 5.2: 1 -10.5,0; 2 10.5,0 | smd 17 x 17: 3 0,0
SOIC127P600X175-8N = smd 1.525 x 0.7: 1 -2.712,1.905; 2 -2.712,0.635; 3 -2.712,-0.635; 4 -2.712,-1.905; 5 2.712,-1.905; 6 2.712,-0.635; 7 2.712,0.635; 8 2.712,1.905
SON127P800X600X80-9N = smd 0.95 x 0.45: 1 -3.9,1.905; 2 -3.9,0.635; 3 -3.9,-0.635; 4 -3.9,-1.905; 5 3.9,-1.905; 6 3.9,-0.635; 7 3.9,0.635; 8 3.9,1.905 | smd 3.45 x 4.35: 9 0,0
74HC4051D653 = smd 0.8 x 1.75: 1 -4.495,-2.825; 8 4.495,-2.825; 9 4.495,2.825; 16 -4.495,2.825 | smd 0.7 x 1.75: 2 -3.175,-2.825; 3 -1.905,-2.825; 4 -0.635,-2.825; 5 0.635,-2.825; 6 1.905,-2.825; 7 3.175,-2.825; 10 3.175,2.825; 11 1.905,2.825; 12 0.635,2.825; 13 -0.635,2.825; 14 -1.905,2.825; 15 -3.175,2.825
SOT95P280X125-5N = smd 0.9 x 0.6: 1 -1.4,0.95; 2 -1.4,0; 3 -1.4,-0.95; 4 1.4,-0.95; 5 1.4,0.95
RELAY_SRD-24VDC-SL-C = drill 1.3: COIL1 -6,6; COIL2 -6,-6; COM -8,0; NC 6.2,6; NO 6.2,-6
INDM4532X340N = smd 2.05 x 1.3: 1 -1.85,0; 2 1.85,0
CUI_TB009-508-03BE = drill 1.6 square: 1 0,0 | drill 1.6: 2 5.08,0; 3 10.16,0
CUTOUT2 = smd 1.27 x 0.635: P$1 0,0
0805L075SLYR = smd 1 x 1.5: 1 -1.1,0; 2 1.1,0
0402-TIGHT = smd 0.6 x 0.6: 1 -0.5,0; 2 0.5,0
R0603 = smd 0.889 x 0.889: 1 0,0.762; 2 0,-0.762
SOT96P250X127-3N = smd 1.25 x 0.6: 1 -1.05,0.955; 2 -1.05,-0.955; 3 1.05,0
TP20SQ = smd 2 x 2: TP 0,0
XCVR_ESP32-C6-WROOM-1U-N4 = smd 1.5 x 0.9: 1 -8.75,8.41; 2 -8.75,7.14; 3 -8.75,5.87; 4 -8.75,4.6; 5 -8.75,3.33; 6 -8.75,2.06; 7 -8.75,0.79; 8 -8.75,-0.48; 9 -8.75,-1.75; 10 -8.75,-3.02; 11 -8.75,-4.29; 12 -8.75,-5.56; 13 -8.75,-6.83; 14 -8.75,-8.1; 15 8.75,-8.1; 16 8.75,-6.83; 17 8.75,-5.56; 18 8.75,-4.29; 19 8.75,-3.02; 20 8.75,-1.75; 21 8.75,-0.48; 22 8.75,0.79; 23 8.75,2.06; 24 8.75,3.33; 25 8.75,4.6; 26 8.75,5.87; 27 8.75,7.14; 28 8.75,8.41 | smd 0.8 x 0.8: 29_1 -2.755,3.94; 29_2 -1.505,3.94; 29_3 -0.255,3.94; 29_4 -2.755,2.69; 29_5 -1.505,2.69; 29_6 -0.255,2.69; 29_7 -2.755,1.44; 29_8 -1.505,1.44; 29_9 -0.255,1.44 | drill 0.25 pad 0.35: 30_1 -2.13,3.94; 30_2 -0.88,3.94; 30_3 -2.755,3.315; 30_4 -1.505,3.315; 30_5 -0.255,3.315; 30_6 -2.13,2.69; 30_7 -0.88,2.69; 30_8 -2.755,2.065; 30_9 -1.505,2.065; 30_10 -0.255,2.065; 30_11 -2.13,1.44; 30_12 -0.88,1.44
SOIC127P1032X265-16N = smd 2.05 x 0.59: 1 -4.655,4.445; 2 -4.655,3.175; 3 -4.655,1.905; 4 -4.655,0.635; 5 -4.655,-0.635; 6 -4.655,-1.905; 7 -4.655,-3.175; 8 -4.655,-4.445; 9 4.655,-4.445; 10 4.655,-3.175; 11 4.655,-1.905; 12 4.655,-0.635; 13 4.655,0.635; 14 4.655,1.905; 15 4.655,3.175; 16 4.655,4.445
TO-263-5_MCH = smd 0.965 x 3.505: 1 -3.404,-9.055; 2 -1.702,-9.055; 3 0,-9.055; 4 1.702,-9.055; 5 3.404,-9.055 | smd 6.553 x 8.458: 6 0,2.743

### Placement (x,y rotation side)
06_LED  78.62,6 270 top
A1_LED  125.86,80 90 top
A1_TERMINALS  130.94,80 0 top
A2_LED  141.1,80 90 top
A2_TERMINALS  146.18,80 0 top
A3_LED  156.34,80 90 top
A3_TERMINALS  161.42,80 0 top
BOOT_BUTTON  116.41,18.22 90 top
C1_0.1U_REG  45,64 0 top
C1_100U_REG  14.94,65 0 top
C2_0.1U_REG  45,67 0 top
C3_0.1U_REG  45,70 0 top
C4_0.1U_REG  41,64 0 top
C5_0.1U_REG  41,67 0 top
C6_0.1U_REG  41,70 0 top
C_330U_REG  42.42,54.55 270 top
C_BOOT  116.2,22.35 0 top
C_ESP32  113.62,32.35 0 top
C_FLASH  102.81,79.35 180 top
C_MUX  151.5,36.16 0 top
C_O1  28.88,37.16 0 top
C_O2  53.07,37.16 180 top
C_O3  79.26,36.16 0 top
C_RESET  107,22.35 0 top
C_RTC  89.5,57.16 90 top
C_SUPERVISOR  111.37,11.54 90 top
D1_LED  156.34,6 270 top
D1_TERMINALS  161.42,6 0 top
D2_LED  141.1,6 270 top
D2_TERMINALS  146.18,6 0 top
D3_LED  125.86,6 270 top
D3_TERMINALS  130.94,6 0 top
D_A1  124.89,63 180 top
D_A2  137.46,63 180 top
D_A3  151.03,63 180 top
D_D1  154.89,24 180 top
D_D2  142.46,24 180 top
D_D3  131.03,24 180 top
D_O1  13.53,40.73 180 top
D_O2  37.56,40.73 180 top
D_O3  62.59,40.73 180 top
D_REG  25.35,56.6 270 top
FL1  154.86,42.57 90 top
FL2  93.62,37.57 90 top
H1  63.7,60.77 180 top
IC2  22.18,42.49 180 top
IC3  47.21,42.49 180 top
IC4  72.24,42.49 180 top
IC5  105.57,72.6 90 top
IC6  146.06,41.97 180 top
IC7  107.49,11.57 0 top
K1  16.5,28 270 top
K2  41,28 270 top
K3  66,28 270 top
L_REG  32.92,59.57 0 top
O1_LED  22.75,6 270 top
O1_TERMINALS  17.65,6 180 top
O2_LED  43.05,6 270 top
O2_TERMINALS  38,6 180 top
O3_LED  63.38,6 270 top
O3_TERMINALS  58.3,6 180 top
O4_LED  68.46,6 270 top
O5_LED  73.54,6 270 top
PINHD_3V3  163,53 0 top
PINHD_DE/RE  163,43 0 top
PINHD_GND  163,58 0 top
PINHD_RX  163,48 0 top
PINHD_TX  163,38 0 top
PINHD_USB_D+  163,33 0 top
PINHD_USB_D-  163,28 0 top
POLYFUSE_REG  47.6,78.9 0 top
R1_A1  128.76,71.35 180 top
R1_A2  139.95,71.35 180 top
R1_A3  153.14,71.35 180 top
R1_D1  158.76,15.65 180 top
R1_D2  144.95,15.65 180 top
R1_D3  133.14,15.65 180 top
R2_A1  125.05,71.3 0 top
R2_A2  136.24,71.3 180 top
R2_A3  149.43,71.3 180 top
R2_D1  155.41,15.7 180 top
R2_D2  141.24,15.7 180 top
R2_D3  129.43,15.7 180 top
R3_A1  128.6,67.5 270 top
R3_A2  140.25,67.5 270 top
R3_A3  153.86,67.5 270 top
R3_D1  158.6,19.5 270 top
R3_D2  145.25,19.5 270 top
R3_D3  133.86,19.5 270 top
R_A1_EMI  130.42,63 0 top
R_A1_LED  121,72 180 top
R_A2_EMI  143.5,63 0 top
R_A2_LED  133,72 180 top
R_A3_EMI  155.71,63 0 top
R_A3_LED  146,72 180 top
R_BOOT  116.33,25.6 90 top
R_D1_EMI  159.18,23.97 0 top
R_D1_LED  152,15 0 top
R_D2_EMI  148.26,23.97 0 top
R_D2_LED  138,15 0 top
R_D3_EMI  136.34,23.97 0 top
R_D3_LED  126,15 0 top
R_ESP32  133.7,33.16 180 top
R_FLASH  99.41,68.6 270 top
R_O1  28.42,28.84 0 top
R_O1_EMI  83.86,42.35 180 top
R_O1_LED  28,19 0 top
R_O1_RELAY  28.5,33.44 180 top
R_O2  53.42,28.84 0 top
R_O2_EMI  83.94,39.35 180 top
R_O2_LED  53,19 0 top
R_O2_RELAY  53.54,33.44 180 top
R_O3  79.26,27.84 0 top
R_O3_EMI  84.02,36.35 180 top
R_O3_LED  78,19 0 top
R_O3_RELAY  79.34,32.44 180 top
R_O4  85.18,27.84 0 top
R_O4_EMI  85.1,31.35 270 top
R_O4_LED  84,19 0 top
R_O5  91.1,27.84 0 top
R_O5_EMI  91.1,31.35 270 top
R_O5_LED  90,19 0 top
R_O6  97.02,27.84 0 top
R_O6_EMI  97.02,31.35 270 top
R_O6_LED  96,19 0 top
R_RESET  106.73,25.6 270 top
R_RTC  87.3,55.22 270 top
REG_TERMINALS  12.58,80 180 top
RESET_BUTTON  106.76,18.22 90 top
T_A1  123.93,67.5 180 top
T_A2  136.07,67.5 180 top
T_A3  149.18,67.5 180 top
T_D1  154.29,19.5 180 top
T_D2  141.07,19.5 180 top
T_D3  129.18,19.5 180 top
T_O1  28.62,23.92 180 top
T_O2  53.62,23.92 180 top
T_O3  78.84,22.92 180 top
T_O4  84.95,22.92 180 top
T_O5  91.06,22.92 180 top
T_O6  96.96,22.92 180 top
TP1  163.9,63 0 top
TP2  162.13,23 0 top
TP3  161.9,63 0 top
TP4  164.1,23 0 top
U1  121.35,43.21 90 top
U2  96.33,53.5 0 top
U3  33.1,73.18 0 top

### Tracks (layer width: path | path; a pad name or v marks a point on that pad's centre or on a via)
3V3  (via drill 0.85)  (1 unrouted)
  Top 0.813: U3.4 34.8,59.6 L_REG.2 34.77,59.23 35.5,58.5 C_330U_REG.1 42.42,63.16 C4_0.1U_REG.2 43,64 | POLYFUSE_REG.1 44.9,78.9 43,77 43,70 | 43,70 43,67 | 43,67 43,64 | POLYFUSE_REG.2 81.1,78.9 v82,78 84,78 | 101,9 101,24 102.6,25.6 R_RESET.2 105.97,26.17 111.14,31.34 113.7,31.34 114.02,31.67 114.02,32.17 C_ESP32.2 U1.2 | 101,9 101,6 104,3 | 104,3 119,3 | 119,3 123,3 | 84,78 86,78 90,82 102.39,82 103.39,81 | 103.39,81 C_FLASH.1 103.66,79.35 103.66,77 | 103.39,81 103.39,82.39 104.44,83.44 126,83.44 | 141,83.44 155.9,83.44 157.61,81.72 A3_LED.2 | 141,83.44 126,83.44 | 103.66,77 IC5.8 IC5.7 | 98.65,71 98.65,76.65 100,78 102.66,78 103.66,77 | 98.65,71 R_FLASH.2 | R_RTC.2 86.59,56.58 | 86.59,56.58 C_RTC.1 89.69,56.67 U2.2 | 86.59,56.58 86.42,56.58 86,57 86,76 84,78 | R_BOOT.2 121,25.6 | 121,25.6 124,25.6 126.4,28 146,28 150.92,32.92 C_MUX.1 150.92,39 150.78,39.14 IC6.16 | 123,3 139,3 | 139,3 153.62,3 155.07,4.45 D1_LED.2 | IC5.3 106.2,68.92 105.12,70 99.65,70 98.65,71 | O1_LED.2 24.48,3 44,3 | 44,3 64,3 | 64,3 69,3 | 69,3 74,3 | 74,3 79,3 | 79,3 v82,3 104,3 | O3_LED.2 62.11,4.89 64,3 | O4_LED.2 67.19,4.81 69,3 | O5_LED.2 72.27,4.73 74,3 | 06_LED.2 77.35,4.65 79,3 | O2_LED.2 41.78,5.22 44,3 | A2_LED.2 142.37,82.06 141,83.44 | A1_LED.2 127.13,82.31 126,83.44 | v163,55.5 PINHD_3V3.P$1 | D3_LED.2 124.59,4.59 123,3 | D2_LED.2 139.83,3.83 139,3 | 119,3 122,6 122,24.6 121,25.6 | C6_0.1U_REG.2 43,70 | C3_0.1U_REG.1 43,70 | C5_0.1U_REG.2 43,67 | C2_0.1U_REG.1 43,67 | C1_0.1U_REG.1 43,64 | 101,9 103.57,11.57 IC7.2 | v137.13,32.87 137,33 134.71,33 R_ESP32.1
  Bottom 0.813: 82,32 v82,78 82,81 85,84 111,84 114,81 114,62 118,58 125.41,58 126.6,56.8 127.6,56.8 128.79,58 160.5,58 v163,55.5 | 82,32 v82,3 | v137.13,32.87 137,32.74 137,30 84,30 82,32
A1
  Top 0.2: FL1.11 152.04,43.17 151.21,44 151.21,45.77 151.06,45.92 150.05,45.92 149.9,45.77 149.9,43.88 149.03,43 146.9,43 146.03,43.88 146.03,45.77 145.88,45.92 144.97,45.92 144.82,45.77 144.82,39.74 IC6.12
A1_INPUT
  Top 0.125: 127.86,71.3 R1_A1.2
  Top 0.2: R_A1_EMI.1 D_A1.1 126.59,63.59 128,65 129.36,66.36 R3_A1.1 129.36,68.64 129,69 127.86,70.14 127.86,71.3 R2_A1.2
A2
  Top 0.2: IC6.1 150.56,43.45 151.23,42.77 FL1.12
A2_INPUT
  Top 0.125: 139.08,63.08 D_A2.1
  Top 0.2: R_A2_EMI.1 139.08,63 139.08,63.08 | D_A2.1 139.16,64.16 141.01,66.01 R3_A2.1 141,67.51 141,69 139.1,70.9 R1_A2.2 139.05,71.3 R2_A2.1
A3
  Top 0.2: IC6.5 145.43,43.58 146.63,42.37 FL1.13
A3_INPUT
  Top 0.125: R1_A3.2 152.24,71.3
  Top 0.2: R_A3_EMI.1 D_A3.1 152.73,63.73 154,65 154.62,65.62 R3_A3.1 154.62,68.38 154,69 152.24,70.76 152.24,71.3 R2_A3.1
BOOT
  Top 0.2: BOOT_BUTTON.4 BOOT_BUTTON.3 C_BOOT.1 115.62,25.55 R_BOOT.1 115.57,26.51 121.83,32.77 U1.8
D1
  Top 0.2: FL1.14 148,41.97 146.69,40.66 IC6.13
D1_INPUT
  Top 0.2: R2_D1.1 157.91,15.7 R1_D1.2 157.91,16.91 159.36,18.36 R3_D1.1 159.36,21.23 D_D1.1 156.62,23.97 R_D1_EMI.1
D2
  Top 0.2: IC6.14 147.97,40.97 148.57,41.57 FL1.15
D2_INPUT
  Top 0.125: R1_D2.2 144.05,15.7
  Top 0.2: 144.05,15.7 R2_D2.1 | R1_D2.2 144.1,17 146.01,18.91 R3_D2.1 146.01,22.15 D_D2.1 147.76,24 R_D2_EMI.1
D3
  Top 0.2: FL1.16 149.41,41.17 149.24,41 IC6.15
D3_INPUT
  Top 0.125: 132.24,15.7 R1_D3.2 | 135.81,24 R_D3_EMI.1
  Top 0.2: R2_D3.1 132.24,15.7 132.24,16.24 134.62,18.62 R3_D3.1 134.62,22.11 D_D3.1 135.81,24
DE/RE  (via drill 0.5)
  Top 0.2: v115.18,54.18 115.18,52.26 U1.26 | v163,45.5 PINHD_DE/RE.P$1
  Bottom 0.2: v163,45.5 160.7,47.8 118.18,47.8 115.18,50.8 v115.18,54.18
FLASH_CS  (via drill 0.5)
  Top 0.2: R_FLASH.1 100.17,68.7 IC5.1 103.66,67.34 105,66 v105.97,66 | U1.19 124.37,53.67 v124.67,53.67
  Bottom 0.2: v124.67,53.67 124.67,54.33 123,56 109,56 105.97,59.03 v105.97,66
GND  (via drill 0.85)
  Top 0.2: U1.29_5 U1.29_4
  Top 0.813: REG_TERMINALS.1 18.29,74.29 C1_100U_REG.2
  other vias: 163,60.5 103,17.5 54,41.5 146.6,34 121.6,28.7 127.1,58 22.2,43 122.8,49.3 143.4,41.9 154.8,39.2 154.8,46.4 74.9,39 80.4,38.1 80.6,34.5 77.1,39 24.9,39 29.9,39 29.8,35.5 26.8,39 107.6,18.1 107.5,14.2 103.1,13.9
  pour Top (isolate 0.254): 0,86 0,0 174,0 174,86
  pour Bottom (isolate 0.254): 0,86 0,0 174,0 174,86
INPUT
  Top 0.2: U1.5 118.02,37.02 119,38 123,38 132,47 147,47 148,46 148,44.79 IC6.3
INT/SQW
  Top 0.125: 116.8,34.51 U1.4
  Top 0.2: R_RTC.1 91.67,55.22 U2.3 95.41,55.41 100,60 128,60 130.24,57.77 130.24,46.74 122.5,39 118.1,39 116.8,37.7 116.8,34.51
MISO  (via drill 0.5)
  Top 0.2: IC5.2 104.94,67.06 v104.97,67.03 | U1.27 114.21,53.79 113.71,54.29 v112,54.29
  Bottom 0.2: v112,54.29 111.96,54.34 109.66,54.34 104.97,59.03 v104.97,67.03
MOSI  (via drill 0.5)
  Top 0.2: IC5.5 107.47,77.35 106.91,77.91 v106.91,77.94 | v119,32 120.56,33.56 U1.7
  Bottom 0.2: v119,32 119,33 118,34 89,34 87,36 87,77 89,79 105.82,79 106.88,77.94 v106.91,77.94
N$1
  Top 0.2: R_D3_EMI.2 136.84,24.84 139,27 157,27 158,28 158,40 156.83,41.17 FL1.1
N$2
  Top 0.2: R_D2_EMI.2 148.76,24.76 150,26 157,26 158.35,27.35 158.35,40.65 157.43,41.57 FL1.2
N$3
  Top 0.2: FL1.4 155.46,42.39 158.47,42.39 159,42.92 159,57 156.21,59.79 R_A3_EMI.2
N$4
  Top 0.2: FL1.3 158,41.97 159,40.97 159,27.65 159.68,26.97 R_D1_EMI.2
N$5
  Top 0.2: R_A2_EMI.2 144,61 146,59 156,59 158.35,56.65 158.35,43.35 157.77,42.77 FL1.5
N$6
  Top 0.2: R_A1_EMI.2 130.92,60.08 133,58 156,58 158,56 158,44 157.17,43.17 FL1.6
N$7
  Top 0.813: A1_TERMINALS.2 131,74.98 131,72.74 R1_A1.1
N$8
  Top 0.2: T_A1.1 124.98,66.98 125.5,67.5 R3_A1.2
N$9
  Top 0.2: R_A1_LED.1 122.88,69.36 T_A1.3
N$10
  Top 0.813: R1_A2.1 142.35,71.35 151,80 A2_TERMINALS.2
N$11
  Top 0.2: R_A1_LED.2 121,76.41 A1_LED.1
N$12
  Top 0.2: T_A2.1 137.12,67 137.62,67.5 R3_A2.2
N$13
  Top 0.2: R_A2_LED.1 135.02,69.22 T_A2.3
N$14
  Top 0.2: R_A2_LED.2 133,73.76 139.24,80 A2_LED.1
N$15
  Top 0.2: T_A3.1 150.23,67.5 R3_A3.2
N$16
  Top 0.2: R_A3_LED.1 148.13,69.11 T_A3.3
N$17
  Top 0.2: R_A3_LED.2 146,74 149,77 152.07,77 A3_LED.1
N$18
  Top 0.2: T_D1.1 155.9,19.1 156.3,19.5 R3_D1.2
N$19
  Top 0.2: R_D1_LED.1 152,18.26 T_D1.3
N$20
  Top 0.2: R_D1_LED.2 152,13.24 157.61,7.63 D1_LED.1
N$21
  Top 0.813: R1_D1.1 161.35,15.65 165.5,11.5 165.5,7 D1_TERMINALS.2
N$22
  Top 0.813: R1_A3.1 157.85,71.35 A3_TERMINALS.2
N$23
  Top 0.813: R1_D2.1 146.35,15.65 150.26,11.74 150.26,7 D2_TERMINALS.2
N$24
  Top 0.813: R1_D3.1 135.35,15.65 136.02,14.98 D3_TERMINALS.2
N$25
  Top 0.2: R_D2_LED.1 138,18 139.5,19.5 T_D2.3
N$26
  Top 0.2: R_D2_LED.2 138,13.24 142.37,8.87 D2_LED.1
N$27
  Top 0.2: T_D2.1 143.12,19.55 143.12,19.5 R3_D2.2
N$28
  Top 0.2: R_D3_LED.1 126,18 127.5,19.5 T_D3.3
N$29
  Top 0.2: R3_D3.2 131.19,19.5 T_D3.1
N$30
  Top 0.2: D3_LED.1 126,7.13 R_D3_LED.2
N$31
  Top 0.2: T_O1.3 28,23.49 R_O1_LED.1
N$32
  Top 0.2: R_O1_LED.2 28,17.24 24.02,13.26 O1_LED.1
N$33
  Top 0.2: T_O2.3 53,23.49 R_O2_LED.1
N$34
  Top 0.2: R_O4_EMI.1 85.1,33.2 88.87,36.97 FL2.14
N$35
  Top 0.2: R_O3_EMI.1 85.87,36.35 86.89,37.37 FL2.13
N$36
  Top 0.2: R_O2_EMI.1 85.79,39.35 87.37,37.77 FL2.12
N$37
  Top 0.2: R_O1_EMI.1 85.71,42.35 89.89,38.17 FL2.11
N$38
  Top 0.2: FL2.15 93.02,36.55 91.74,36.55 91.1,35.91 R_O5_EMI.1
N$39
  Top 0.2: FL2.16 92.17,36.17 92,36 92,35.08 93.08,34 96,34 97.02,32.98 R_O6_EMI.1
N$40
  Top 0.2: T_O5.1 91,23.07 91,27.08 R_O5.2
N$41
  Top 0.2: R_O1.2 28.42,24.47 28.45,24.47 28.45,23.55 29.03,22.96 T_O1.1
N$42
  Top 0.2: R_O2_LED.2 53,17 51,15 47,15 44.32,12.32 O2_LED.1
N$43
  Top 0.2: R_O3_LED.1 78,22.71 T_O3.3
N$44
  Top 0.2: R_O3_LED.2 78,16.24 76.76,15 68,15 64.65,11.65 O3_LED.1
N$45
  Top 0.2: R_O2.2 53.42,24.35 54.67,23.1 T_O2.1
N$46
  Top 0.2: R_O4_LED.1 84,22.82 T_O4.3
N$47
  Top 0.2: R_O4_LED.2 84,16 82,14 72,14 69.73,11.73 O4_LED.1
N$48
  Top 0.2: R_O5_LED.1 T_O5.3
N$49
  Top 0.2: R_O5_LED.2 90,17 86,13 76,13 74.81,11.81 O5_LED.1
N$50
  Top 0.2: T_O4.1 86,22 85,23 85,27.08 R_O4.2
N$51
  Top 0.2: T_O3.1 79.89,22 79,22.89 79,27.08 R_O3.2
N$52
  Top 0.2: R_O6_LED.1 95.91,19.85 T_O6.3
N$53
  Top 0.2: R_O6_LED.2 96,17 91,12 81,12 79.89,10.89 06_LED.1
N$54
  Bottom 0.813: K1.NO 10.5,13.5 7,10 7,6.49 O1_TERMINALS.3
N$55
  Bottom 0.813: K1.COM 14.57,34.07 14.57,8 O1_TERMINALS.2
N$56
  Top 0.2: R_O6.2 97,27.08 97,22.98 T_O6.1
N$57
  Bottom 0.813: K1.NC 17.65,16.95 O1_TERMINALS.1
N$58
  Top 0.2: R_O1_RELAY.2 28.3,34.2 C_O1.1 28.3,39.7 26.15,41.85 IC2.2
N$59
  Top 0.813: K1.COIL1 22.5,35.5 20,38 16,38 15.23,38.77 D_O1.1 16.42,40.73 17.53,39.62 22.62,39.62 23.57,40.57 23.57,42.44 23.9,42.76 24.53,42.76 IC2.3
N$60
  Bottom 0.813: K2.NO 27.84,14.64 O2_TERMINALS.3
N$61
  Bottom 0.813: K2.COM 41,23 32.92,14.92 O2_TERMINALS.2
N$62
  Bottom 0.813: K2.NC 38,12.8 O2_TERMINALS.1
N$63
  Top 0.2: IC3.2 51.12,41.85 53.65,39.33 C_O2.1 53.65,34.31 R_O2_RELAY.2
N$64
  Top 0.813: IC3.3 49.12,43.12 48.6,42.6 48.6,41.6 46,39 42,39 41,40 40.27,40.73 D_O2.1 39.26,38.74 40.37,37.63 45.37,37.63 47,36 K2.COIL1
N$65
  Bottom 0.813: K3.NO 48.14,9.94 O3_TERMINALS.3
N$66
  Bottom 0.813: O3_TERMINALS.2 53,6.22 53,10 57.34,14.34 57.34,16.9 66,25.57 K3.COM
N$67
  Bottom 0.813: K3.NC 63.6,21.8 58.3,16.5 O3_TERMINALS.1
N$68
  Top 0.2: IC4.2 77.14,41.85 78.68,40.32 C_O3.1 78.68,35.32 79.34,34.66 R_O3_RELAY.2
N$69
  Top 0.813: IC4.3 74.12,43.12 73,42 73,40 71.91,38.91 66.29,38.91 66.29,39.71 65.27,40.73 D_O3.1 64.29,38.71 65.36,37.63 70.36,37.63 72,36 K3.COIL1
N$71
  Top 0.2: IC7.5 111.37,12.52 C_SUPERVISOR.2
N$76
  Top 0.2: H1.2 53.2,68.2 56,71 71,71 74.2,67.8 H1.1 77,57.97 77,54 80,51 96,51 99,54 100.41,55.41 U2.14
N$77
  Top 0.813: D_REG.1 25.83,59.57 L_REG.1 31.36,59.86 31.36,64.09 U3.2
O1  (via drill 0.5)
  Top 0.2: v99,39 98.17,38.17 FL2.6 | U1.11 125.64,32.36 126,32 v129,32
  Bottom 0.2: v129,32 129,36 126,39 v99,39
O1_OUTPUT
  Top 0.2: R_O1.1 28.5,29.6 R_O1_RELAY.1 29.68,32.68 32,35 32,41 34,43 42,43 43,42 43,40.61 43.69,39.93 45.31,39.93 46.51,41.13 46.51,42.97 47.33,43.78 66.22,43.78 68.35,41.65 68.35,40.29 68.72,39.93 70.34,39.93 71.54,41.13 71.54,43.83 72.71,45 81,45 83.01,42.99 R_O1_EMI.2
O2
  Top 0.2: U1.23 119.29,47.79 118.36,46.86 111.69,46.86 102.61,37.77 FL2.5
O2_OUTPUT
  Top 0.2: R_O2.1 53.42,32.68 R_O2_RELAY.1 56,35.14 56,41 58,43 66,43 68,41 68,40.15 68.57,39.57 70.48,39.57 72,41.09 72,43.06 72.74,43.79 78.65,43.79 R_O2_EMI.2
O3
  Top 0.2: U1.18 125.64,47.04 124.91,46.3 111.64,46.3 102.73,37.39 94.22,37.39 FL2.4
O3_OUTPUT
  Top 0.125: 79.26,31.6 R_O3_RELAY.1
  Top 0.2: 79.26,31.6 R_O3.1 80.6,28.6 82,30 82,36 82.35,36.35 R_O3_EMI.2
O4
  Top 0.2: U1.17 126.91,46.71 125.95,45.75 111.59,45.75 102.8,36.97 FL2.3
O4_OUTPUT
  Top 0.2: R_O4.1 85.1,28.6 R_O4_EMI.2
O5
  Top 0.2: FL2.2 102.9,36.57 111.53,45.2 126.3,45.2 128,46.9 128,51.78 U1.16
O5_OUTPUT
  Top 0.2: R_O5.1 R_O5_EMI.2
O6
  Top 0.2: FL2.1 103,36.17 111.48,44.65 126.65,44.65 129.45,47.45 U1.15
O6_OUTPUT
  Top 0.2: R_O6.1 R_O6_EMI.2
RESET
  Top 0.2: U1.3 115.48,31.48 114.35,30.35 112.24,30.35 R_RESET.1 107.49,23.69 C_RESET.1 105.96,22.16 RESET_BUTTON.3 RESET_BUTTON.4 105.96,12.65 IC7.1
RX  (via drill 0.5)
  Top 0.2: U1.24 118.02,53.35 117.29,54.08 v117.29,54.29 | v163,50.5 PINHD_RX.P$1
  Bottom 0.2: v163,50.5 118.5,50.5 117.29,51.71 v117.29,54.29
S0
  Top 0.2: U1.9 123,34.46 123,31 124,30 137.56,30 144.16,36.59 IC6.11
S1
  Top 0.2: U1.10 124.37,31.63 125,31 132,31 | 132,31 137.06,31 142.88,36.82 IC6.10 | R_ESP32.2 132.85,31.85 132,31
S2
  Top 0.2: IC6.9 141.56,37.56 139.46,35.46 128,35.46 127.62,35.46 127.46,35.46 126.91,34.91 U1.12
SCK  (via drill 0.5)
  Top 0.2: v106.94,79 106.2,78.26 IC5.6 | v117.94,32 119.29,33.35 U1.6
  Bottom 0.2: v117.94,32 117.94,32.06 117,33 89,33 86,36 86,77 89,80 105.94,80 v106.94,79
SCL
  Top 0.2: U1.21 121.83,57.12 121,57.95 U2.16
SDA
  Top 0.2: U1.20 123,51.96 123,57 121,59 100,59 99,58 99,57 99.33,56.67 U2.15
TX  (via drill 0.5)
  Top 0.2: U1.25 117,51.96 117,53 116.23,53.77 v116.23,54.29 | v163,40.5 PINHD_TX.P$1
  Bottom 0.2: v163,40.5 159.5,44 119.13,44 113,50.13 113,54 114,55 115.41,55 116.12,54.29 v116.23,54.29
USB_D+  (via drill 0.5)
  Top 0.2: U1.14 129.45,34 131.12,32.33 v131.12,32 | v163,35.5 PINHD_USB_D+.P$1
  Bottom 0.2: v131.12,32 131.12,32.12 134.5,35.5 v163,35.5
USB_D-  (via drill 0.5)
  Top 0.2: v163,30.5 PINHD_USB_D-.P$1 | U1.13 128.18,33.88 v130.06,32
  Bottom 0.2: v130.06,32 131.06,31 133,31 135.76,33.76 145.58,33.76 146.23,33.11 160.39,33.11 v163,30.5
V_IN
  Top 0.813: 9.59,61 9.59,63 C1_100U_REG.1 11.59,75.91 REG_TERMINALS.2 | 9.59,61 9.59,46.41 10.61,45.4 18.47,45.4 IC2.5 | U3.1 23.7,64.12 19.57,60 10.59,60 9.59,61 | IC2.8 IC2.7 IC2.6 IC2.5 | IC2.5 20.38,45.3 43.59,45.3 IC3.5 | IC3.5 IC3.6 IC3.7 IC3.8 | IC3.5 45.41,45.3 68.7,45.3 69.53,44.47 IC4.5 IC4.6 IC4.7 IC4.8